# Altium schematic sheet DIMM_CONNECTOR.SchDoc
size A3
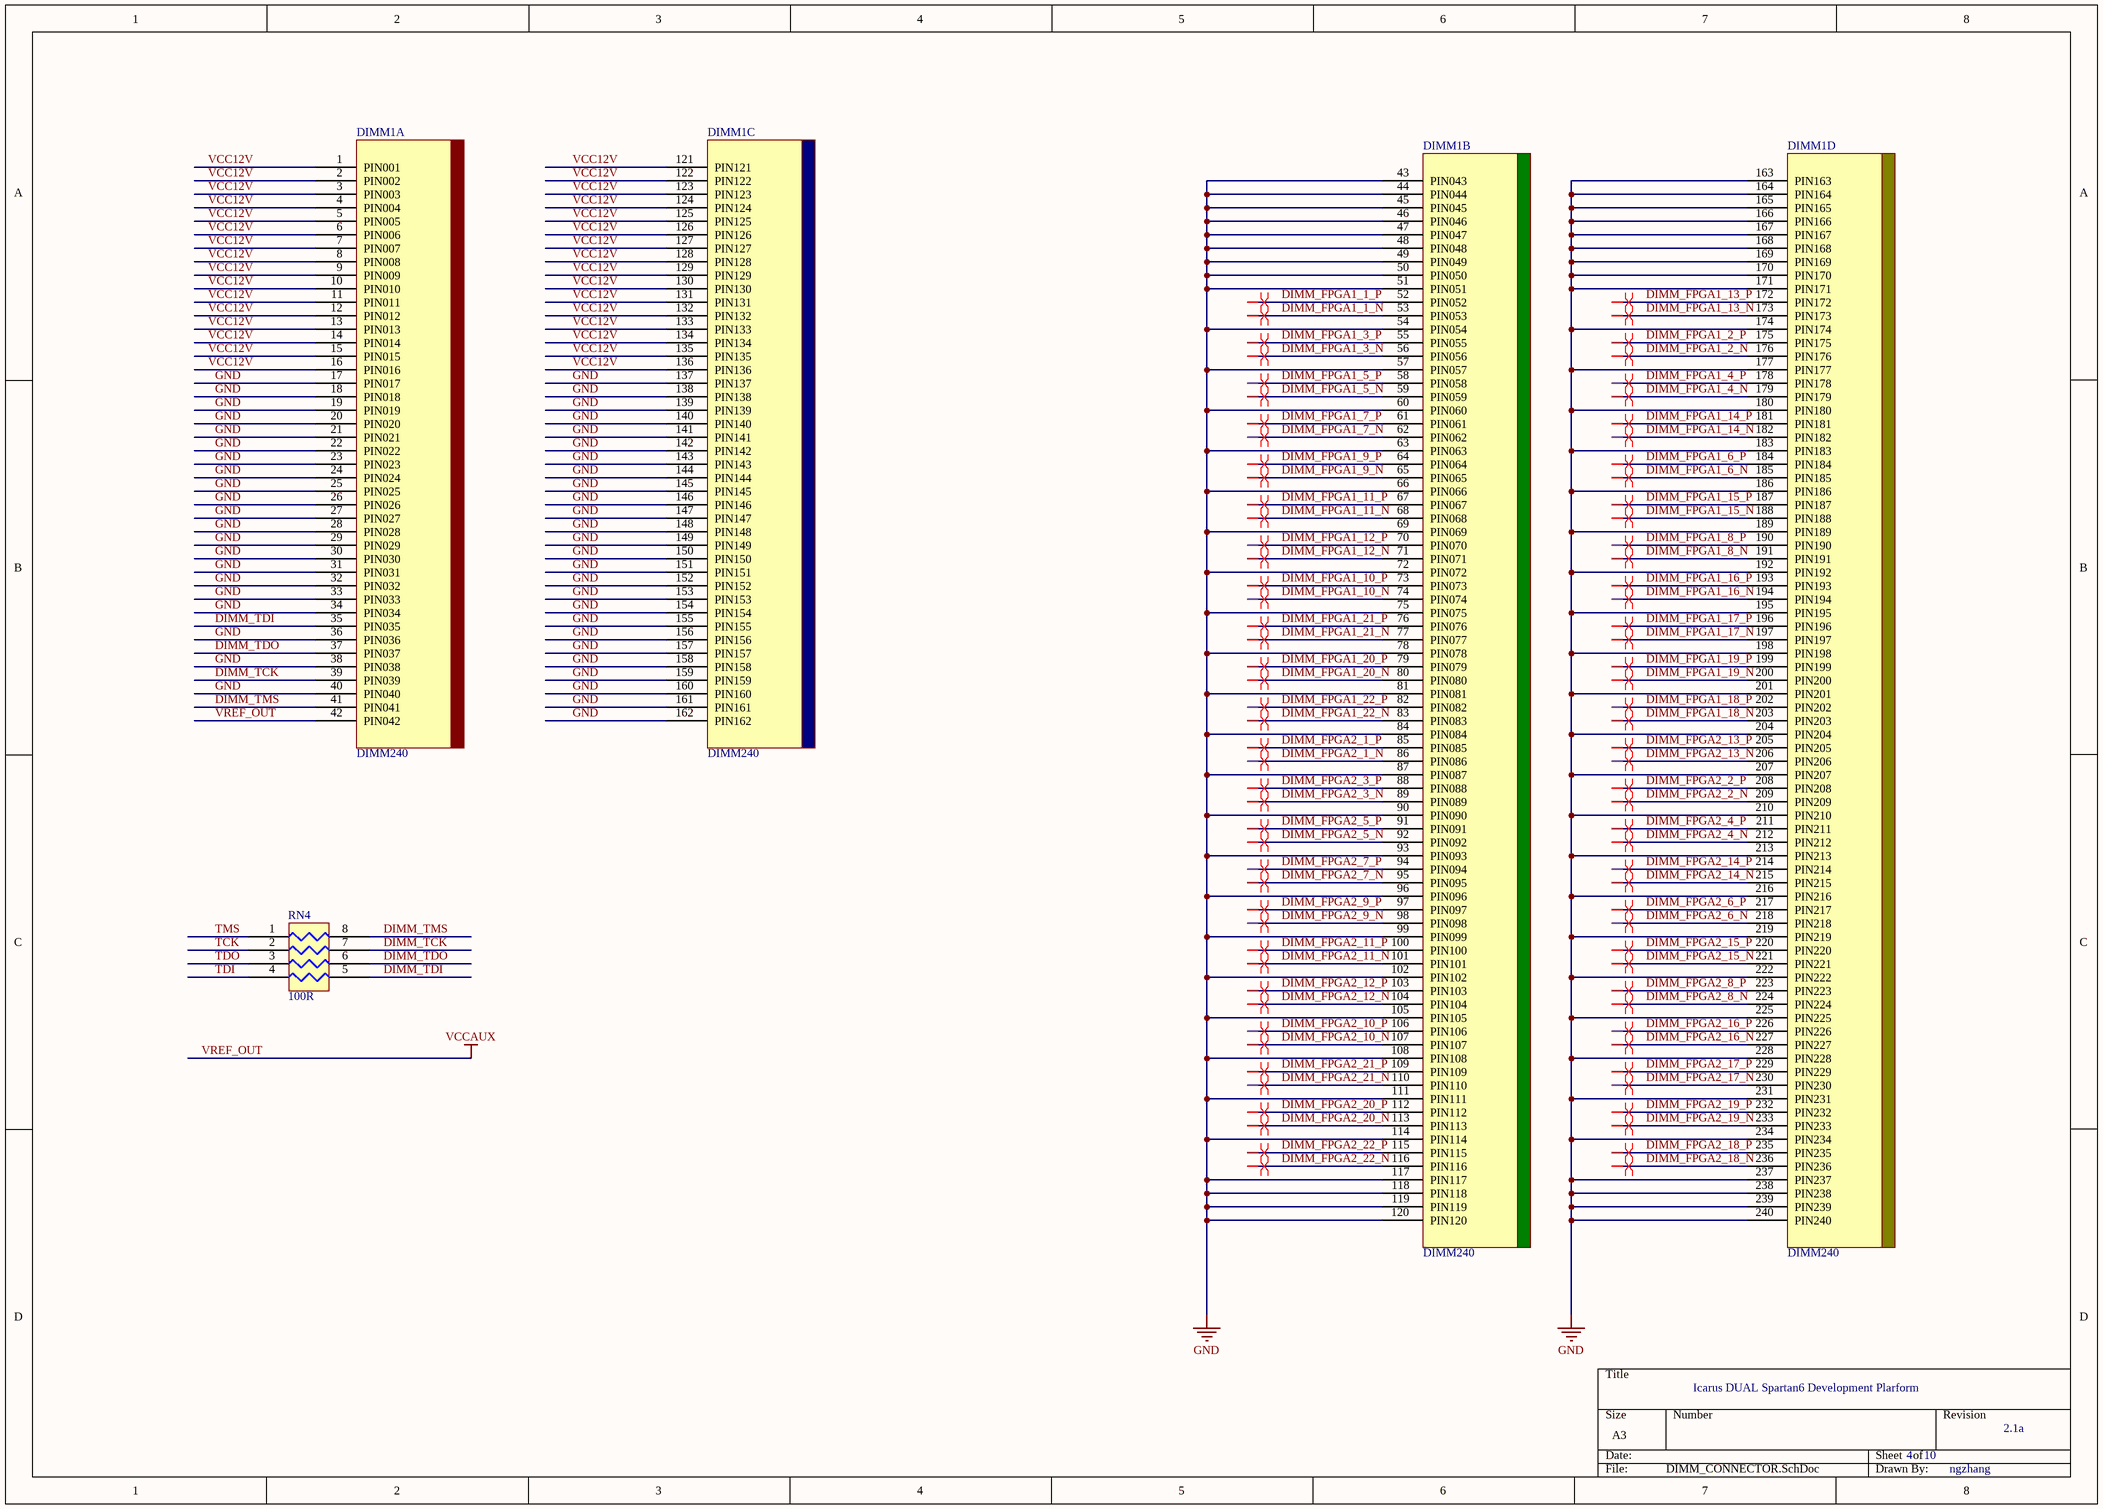
[diagram p0: DIMM_CONNECTOR.SchDoc]

## Parts
DIMM1  DIMM240  [DIMM240]  (parts A,B,C,D of 4)
RN4  100R  [EXBV8V]

## Nets
GND: DIMM1.17(PIN017) DIMM1.18(PIN018) DIMM1.19(PIN019) DIMM1.20(PIN020) DIMM1.21(PIN021) DIMM1.22(PIN022) DIMM1.23(PIN023) DIMM1.24(PIN024) DIMM1.25(PIN025) DIMM1.26(PIN026) DIMM1.27(PIN027) DIMM1.28(PIN028) DIMM1.29(PIN029) DIMM1.30(PIN030) DIMM1.31(PIN031) DIMM1.32(PIN032) DIMM1.33(PIN033) DIMM1.34(PIN034) DIMM1.36(PIN036) DIMM1.38(PIN038) DIMM1.40(PIN040) DIMM1.43(PIN043) DIMM1.44(PIN044) DIMM1.45(PIN045) DIMM1.46(PIN046) DIMM1.47(PIN047) DIMM1.48(PIN048) DIMM1.49(PIN049) DIMM1.50(PIN050) DIMM1.51(PIN051) DIMM1.54(PIN054) DIMM1.57(PIN057) DIMM1.60(PIN060) DIMM1.63(PIN063) DIMM1.66(PIN066) DIMM1.69(PIN069) DIMM1.72(PIN072) DIMM1.75(PIN075) DIMM1.78(PIN078) DIMM1.81(PIN081) DIMM1.84(PIN084) DIMM1.87(PIN087) DIMM1.90(PIN090) DIMM1.93(PIN093) DIMM1.96(PIN096) DIMM1.99(PIN099) DIMM1.102(PIN102) DIMM1.105(PIN105) DIMM1.108(PIN108) DIMM1.111(PIN111) DIMM1.114(PIN114) DIMM1.117(PIN117) DIMM1.118(PIN118) DIMM1.119(PIN119) DIMM1.120(PIN120) DIMM1.137(PIN137) DIMM1.138(PIN138) DIMM1.139(PIN139) DIMM1.140(PIN140) DIMM1.141(PIN141) DIMM1.142(PIN142) DIMM1.143(PIN143) DIMM1.144(PIN144) DIMM1.145(PIN145) DIMM1.146(PIN146) DIMM1.147(PIN147) DIMM1.148(PIN148) DIMM1.149(PIN149) DIMM1.150(PIN150) DIMM1.151(PIN151) DIMM1.152(PIN152) DIMM1.153(PIN153) DIMM1.154(PIN154) DIMM1.155(PIN155) DIMM1.156(PIN156) DIMM1.157(PIN157) DIMM1.158(PIN158) DIMM1.159(PIN159) DIMM1.160(PIN160) DIMM1.161(PIN161) DIMM1.162(PIN162) DIMM1.163(PIN163) DIMM1.164(PIN164) DIMM1.165(PIN165) DIMM1.166(PIN166) DIMM1.167(PIN167) DIMM1.168(PIN168) DIMM1.169(PIN169) DIMM1.170(PIN170) DIMM1.171(PIN171) DIMM1.174(PIN174) DIMM1.177(PIN177) DIMM1.180(PIN180) DIMM1.183(PIN183) DIMM1.186(PIN186) DIMM1.189(PIN189) DIMM1.192(PIN192) DIMM1.195(PIN195) DIMM1.198(PIN198) DIMM1.201(PIN201) DIMM1.204(PIN204) DIMM1.207(PIN207) DIMM1.210(PIN210) DIMM1.213(PIN213) DIMM1.216(PIN216) DIMM1.219(PIN219) DIMM1.222(PIN222) DIMM1.225(PIN225) DIMM1.228(PIN228) DIMM1.231(PIN231) DIMM1.234(PIN234) DIMM1.237(PIN237) DIMM1.238(PIN238) DIMM1.239(PIN239) DIMM1.240(PIN240)
VREF_OUT: DIMM1.42(PIN042)  [also labelled VCCAUX]
DIMM_FPGA1_1_N: DIMM1.53(PIN053)
DIMM_FPGA1_1_P: DIMM1.52(PIN052)
DIMM_FPGA1_2_N: DIMM1.176(PIN176)
DIMM_FPGA1_2_P: DIMM1.175(PIN175)
DIMM_FPGA1_3_N: DIMM1.56(PIN056)
DIMM_FPGA1_3_P: DIMM1.55(PIN055)
DIMM_FPGA1_4_N: DIMM1.179(PIN179)
DIMM_FPGA1_4_P: DIMM1.178(PIN178)
DIMM_FPGA1_5_N: DIMM1.59(PIN059)
DIMM_FPGA1_5_P: DIMM1.58(PIN058)
DIMM_FPGA1_6_N: DIMM1.185(PIN185)
DIMM_FPGA1_6_P: DIMM1.184(PIN184)
DIMM_FPGA1_7_N: DIMM1.62(PIN062)
DIMM_FPGA1_7_P: DIMM1.61(PIN061)
DIMM_FPGA1_8_N: DIMM1.191(PIN191)
DIMM_FPGA1_8_P: DIMM1.190(PIN190)
DIMM_FPGA1_9_N: DIMM1.65(PIN065)
DIMM_FPGA1_9_P: DIMM1.64(PIN064)
DIMM_FPGA1_10_N: DIMM1.74(PIN074)
DIMM_FPGA1_10_P: DIMM1.73(PIN073)
DIMM_FPGA1_11_N: DIMM1.68(PIN068)
DIMM_FPGA1_11_P: DIMM1.67(PIN067)
DIMM_FPGA1_12_N: DIMM1.71(PIN071)
DIMM_FPGA1_12_P: DIMM1.70(PIN070)
DIMM_FPGA1_13_N: DIMM1.173(PIN173)
DIMM_FPGA1_13_P: DIMM1.172(PIN172)
DIMM_FPGA1_14_N: DIMM1.182(PIN182)
DIMM_FPGA1_14_P: DIMM1.181(PIN181)
DIMM_FPGA1_15_N: DIMM1.188(PIN188)
DIMM_FPGA1_15_P: DIMM1.187(PIN187)
DIMM_FPGA1_16_N: DIMM1.194(PIN194)
DIMM_FPGA1_16_P: DIMM1.193(PIN193)
DIMM_FPGA1_17_N: DIMM1.197(PIN197)
DIMM_FPGA1_17_P: DIMM1.196(PIN196)
DIMM_FPGA1_18_N: DIMM1.203(PIN203)
DIMM_FPGA1_18_P: DIMM1.202(PIN202)
DIMM_FPGA1_19_N: DIMM1.200(PIN200)
DIMM_FPGA1_19_P: DIMM1.199(PIN199)
DIMM_FPGA1_20_N: DIMM1.80(PIN080)
DIMM_FPGA1_20_P: DIMM1.79(PIN079)
DIMM_FPGA1_21_N: DIMM1.77(PIN077)
DIMM_FPGA1_21_P: DIMM1.76(PIN076)
DIMM_FPGA1_22_N: DIMM1.83(PIN083)
DIMM_FPGA1_22_P: DIMM1.82(PIN082)
DIMM_FPGA2_1_N: DIMM1.86(PIN086)
DIMM_FPGA2_1_P: DIMM1.85(PIN085)
DIMM_FPGA2_2_N: DIMM1.209(PIN209)
DIMM_FPGA2_2_P: DIMM1.208(PIN208)
DIMM_FPGA2_3_N: DIMM1.89(PIN089)
DIMM_FPGA2_3_P: DIMM1.88(PIN088)
DIMM_FPGA2_4_N: DIMM1.212(PIN212)
DIMM_FPGA2_4_P: DIMM1.211(PIN211)
DIMM_FPGA2_5_N: DIMM1.92(PIN092)
DIMM_FPGA2_5_P: DIMM1.91(PIN091)
DIMM_FPGA2_6_N: DIMM1.218(PIN218)
DIMM_FPGA2_6_P: DIMM1.217(PIN217)
DIMM_FPGA2_7_N: DIMM1.95(PIN095)
DIMM_FPGA2_7_P: DIMM1.94(PIN094)
DIMM_FPGA2_8_N: DIMM1.224(PIN224)
DIMM_FPGA2_8_P: DIMM1.223(PIN223)
DIMM_FPGA2_9_N: DIMM1.98(PIN098)
DIMM_FPGA2_9_P: DIMM1.97(PIN097)
DIMM_FPGA2_10_N: DIMM1.107(PIN107)
DIMM_FPGA2_10_P: DIMM1.106(PIN106)
DIMM_FPGA2_11_N: DIMM1.101(PIN101)
DIMM_FPGA2_11_P: DIMM1.100(PIN100)
DIMM_FPGA2_12_N: DIMM1.104(PIN104)
DIMM_FPGA2_12_P: DIMM1.103(PIN103)
DIMM_FPGA2_13_N: DIMM1.206(PIN206)
DIMM_FPGA2_13_P: DIMM1.205(PIN205)
DIMM_FPGA2_14_N: DIMM1.215(PIN215)
DIMM_FPGA2_14_P: DIMM1.214(PIN214)
DIMM_FPGA2_15_N: DIMM1.221(PIN221)
DIMM_FPGA2_15_P: DIMM1.220(PIN220)
DIMM_FPGA2_16_N: DIMM1.227(PIN227)
DIMM_FPGA2_16_P: DIMM1.226(PIN226)
DIMM_FPGA2_17_N: DIMM1.230(PIN230)
DIMM_FPGA2_17_P: DIMM1.229(PIN229)
DIMM_FPGA2_18_N: DIMM1.236(PIN236)
DIMM_FPGA2_18_P: DIMM1.235(PIN235)
DIMM_FPGA2_19_N: DIMM1.233(PIN233)
DIMM_FPGA2_19_P: DIMM1.232(PIN232)
DIMM_FPGA2_20_N: DIMM1.113(PIN113)
DIMM_FPGA2_20_P: DIMM1.112(PIN112)
DIMM_FPGA2_21_N: DIMM1.110(PIN110)
DIMM_FPGA2_21_P: DIMM1.109(PIN109)
DIMM_FPGA2_22_N: DIMM1.116(PIN116)
DIMM_FPGA2_22_P: DIMM1.115(PIN115)
DIMM_TCK: DIMM1.39(PIN039) RN4.7
DIMM_TDI: DIMM1.35(PIN035) RN4.5
DIMM_TDO: DIMM1.37(PIN037) RN4.6
DIMM_TMS: DIMM1.41(PIN041) RN4.8
TCK: RN4.2
TDI: RN4.4
TDO: RN4.3
TMS: RN4.1
VCC12V: DIMM1.1(PIN001) DIMM1.2(PIN002) DIMM1.3(PIN003) DIMM1.4(PIN004) DIMM1.5(PIN005) DIMM1.6(PIN006) DIMM1.7(PIN007) DIMM1.8(PIN008) DIMM1.9(PIN009) DIMM1.10(PIN010) DIMM1.11(PIN011) DIMM1.12(PIN012) DIMM1.13(PIN013) DIMM1.14(PIN014) DIMM1.15(PIN015) DIMM1.16(PIN016) DIMM1.121(PIN121) DIMM1.122(PIN122) DIMM1.123(PIN123) DIMM1.124(PIN124) DIMM1.125(PIN125) DIMM1.126(PIN126) DIMM1.127(PIN127) DIMM1.128(PIN128) DIMM1.129(PIN129) DIMM1.130(PIN130) DIMM1.131(PIN131) DIMM1.132(PIN132) DIMM1.133(PIN133) DIMM1.134(PIN134) DIMM1.135(PIN135) DIMM1.136(PIN136)

## Layout directives
differential pair: DIMM_FPGA1_1_N, DIMM_FPGA1_1_P, DIMM_FPGA1_2_N, DIMM_FPGA1_2_P, DIMM_FPGA1_3_N, DIMM_FPGA1_3_P, DIMM_FPGA1_4_N, DIMM_FPGA1_4_P, DIMM_FPGA1_5_N, DIMM_FPGA1_5_P, DIMM_FPGA1_6_N, DIMM_FPGA1_6_P, DIMM_FPGA1_7_N, DIMM_FPGA1_7_P, DIMM_FPGA1_8_N, DIMM_FPGA1_8_P, DIMM_FPGA1_9_N, DIMM_FPGA1_9_P, DIMM_FPGA1_10_N, DIMM_FPGA1_10_P, DIMM_FPGA1_11_N, DIMM_FPGA1_11_P, DIMM_FPGA1_12_N, DIMM_FPGA1_12_P, DIMM_FPGA1_13_N, DIMM_FPGA1_13_P, DIMM_FPGA1_14_N, DIMM_FPGA1_14_P, DIMM_FPGA1_15_N, DIMM_FPGA1_15_P, DIMM_FPGA1_16_N, DIMM_FPGA1_16_P, DIMM_FPGA1_17_N, DIMM_FPGA1_17_P, DIMM_FPGA1_18_N, DIMM_FPGA1_18_P, DIMM_FPGA1_19_N, DIMM_FPGA1_19_P, DIMM_FPGA1_20_N, DIMM_FPGA1_20_P, DIMM_FPGA1_21_N, DIMM_FPGA1_21_P, DIMM_FPGA1_22_N, DIMM_FPGA1_22_P, DIMM_FPGA2_1_N, DIMM_FPGA2_1_P, DIMM_FPGA2_2_N, DIMM_FPGA2_2_P, DIMM_FPGA2_3_N, DIMM_FPGA2_3_P, DIMM_FPGA2_4_N, DIMM_FPGA2_4_P, DIMM_FPGA2_5_N, DIMM_FPGA2_5_P, DIMM_FPGA2_6_N, DIMM_FPGA2_6_P, DIMM_FPGA2_7_N, DIMM_FPGA2_7_P, DIMM_FPGA2_8_N, DIMM_FPGA2_8_P, DIMM_FPGA2_9_N, DIMM_FPGA2_9_P, DIMM_FPGA2_10_N, DIMM_FPGA2_10_P, DIMM_FPGA2_11_N, DIMM_FPGA2_11_P, DIMM_FPGA2_12_N, DIMM_FPGA2_12_P, DIMM_FPGA2_13_N, DIMM_FPGA2_13_P, DIMM_FPGA2_14_N, DIMM_FPGA2_14_P, DIMM_FPGA2_15_N, DIMM_FPGA2_15_P, DIMM_FPGA2_16_N, DIMM_FPGA2_16_P, DIMM_FPGA2_17_N, DIMM_FPGA2_17_P, DIMM_FPGA2_18_N, DIMM_FPGA2_18_P, DIMM_FPGA2_19_N, DIMM_FPGA2_19_P, DIMM_FPGA2_20_N, DIMM_FPGA2_20_P, DIMM_FPGA2_21_N, DIMM_FPGA2_21_P, DIMM_FPGA2_22_N, DIMM_FPGA2_22_P

## Notes on the sheet
- Icarus DUAL Spartan6 Development Plarform
- 4
- 10
- 2.1a
- ngzhang

## Library data of the parts
RN4 = RES4PACK